# Altium schematic sheet Microcontroller_07.SchDoc
size A4; SheetNumber: 8; SheetTotal: 9
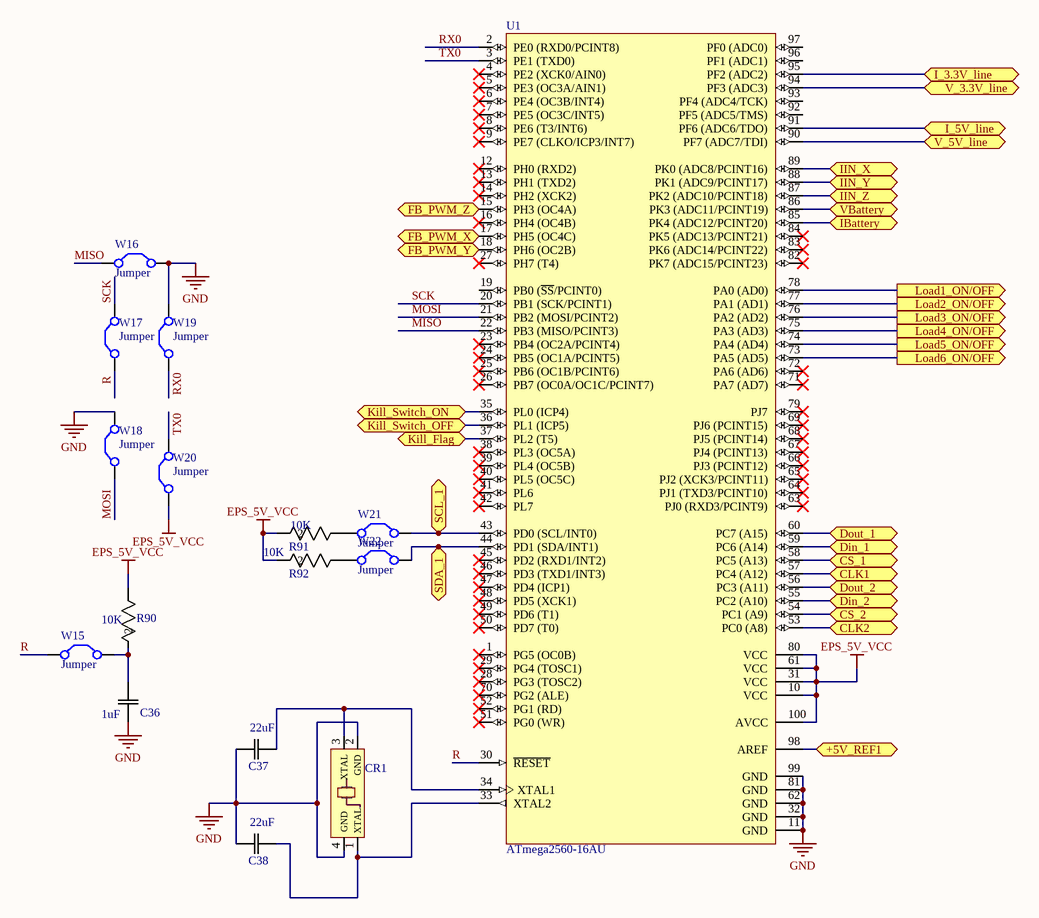
[diagram p0: Microcontroller_07.SchDoc]

## Parts
C36  1uF  [0805]
C37  22uF  [0805]
C38  22uF  [0805]
CR1  ABM3B-16.000MHZ  [Crystal]  (value not drawn)
R90  10K  [RC0805N]
R91  10K  [RC0805N]
R92  10K  [RC0805N]
U1  ATmega2560-16AU  [100A_M]
W15  Jumper  [RAD-0.1]
W16  Jumper  [RAD-0.1]
W17  Jumper  [RAD-0.1]
W18  Jumper  [RAD-0.1]
W19  Jumper  [RAD-0.1]
W20  Jumper  [RAD-0.1]
W21  Jumper  [RAD-0.1]
W22  Jumper  [RAD-0.1]

## Ports
+5V_REF1, CLK1, CLK2, CS_1, CS_2, Din_1, Din_2, Dout_1, Dout_2, FB_PWM_X, FB_PWM_Y, FB_PWM_Z, I_3.3V_line, I_5V_line, IBattery, IIN_X, IIN_Y, IIN_Z, Kill_Flag, Kill_Switch_OFF, Kill_Switch_ON, Load1_ON/OFF (out), Load2_ON/OFF (out), Load3_ON/OFF (out), Load4_ON/OFF (out), Load5_ON/OFF (out), Load6_ON/OFF (out), SCL_1, SDA_1, V_3.3V_line (bidir), V_5V_line, VBattery

## Nets
EPS_5V_VCC: R90.1 R91.2 R92.2 U1.10(VCC) U1.31(VCC) U1.61(VCC) U1.80(VCC) U1.100(AVCC) W20.1(C1)
GND: C36.1 C37.1 C38.1 CR1.2(GND) CR1.4(GND) U1.11(GND) U1.32(GND) U1.62(GND) U1.81(GND) U1.99(GND) W16.2(C2) W18.2(C2) W19.2(C2)
+5V_REF1: U1.98(AREF) ; port +5V_REF1
CLK1: U1.57(PC4_(A12)) ; port CLK1
CLK2: U1.53(PC0_(A8)) ; port CLK2
CS_1: U1.58(PC5_(A13)) ; port CS_1
CS_2: U1.54(PC1_(A9)) ; port CS_2
Din_1: U1.59(PC6_(A14)) ; port Din_1
Din_2: U1.55(PC2_(A10)) ; port Din_2
Dout_1: U1.60(PC7_(A15)) ; port Dout_1
Dout_2: U1.56(PC3_(A11)) ; port Dout_2
FB_PWM_X: U1.17(PH5_(OC4C)) ; port FB_PWM_X
FB_PWM_Y: U1.18(PH6_(OC2B)) ; port FB_PWM_Y
FB_PWM_Z: U1.15(PH3_(OC4A)) ; port FB_PWM_Z
I_3.3V_line: U1.95(PF2_(ADC2)) ; port I_3.3V_line
I_5V_line: U1.91(PF6_(ADC6/TDO)) ; port I_5V_line
IBattery: U1.85(PK4_(ADC12/PCINT20)) ; port IBattery
IIN_X: U1.89(PK0_(ADC8/PCINT16)) ; port IIN_X
IIN_Y: U1.88(PK1_(ADC9/PCINT17)) ; port IIN_Y
IIN_Z: U1.87(PK2_(ADC10/PCINT18)) ; port IIN_Z
Kill_Flag: U1.37(PL2_(T5)) ; port Kill_Flag
Kill_Switch_OFF: U1.36(PL1_(ICP5)) ; port Kill_Switch_OFF
Kill_Switch_ON: U1.35(PL0_(ICP4)) ; port Kill_Switch_ON
Load1_ON/OFF: U1.78(PA0_(AD0)) ; port Load1_ON/OFF
Load2_ON/OFF: U1.77(PA1_(AD1)) ; port Load2_ON/OFF
Load3_ON/OFF: U1.76(PA2_(AD2)) ; port Load3_ON/OFF
Load4_ON/OFF: U1.75(PA3_(AD3)) ; port Load4_ON/OFF
Load5_ON/OFF: U1.74(PA4_(AD4)) ; port Load5_ON/OFF
Load6_ON/OFF: U1.73(PA5_(AD5)) ; port Load6_ON/OFF
MISO: U1.22(PB3_(MISO/PCINT3)) W16.1(C1)
MOSI: U1.21(PB2_(MOSI/PCINT2)) W18.1(C1)
R: U1.30(~{RESET}) W15.1(C1) W17.1(C1)
RX0: U1.2(PE0_(RXD0/PCINT8)) W19.1(C1)
SCK: U1.20(PB1_(SCK/PCINT1)) W17.2(C2)
SCL_1: U1.43(PD0_(SCL/INT0)) W21.2(C2) ; port SCL_1
SDA_1: U1.44(PD1_(SDA/INT1)) W22.2(C2) ; port SDA_1
TX0: U1.3(PE1_(TXD0)) W20.2(C2)
V_3.3V_line: U1.94(PF3_(ADC3)) ; port V_3.3V_line
V_5V_line: U1.90(PF7_(ADC7/TDI)) ; port V_5V_line
VBattery: U1.86(PK3_(ADC11/PCINT19)) ; port VBattery
NetC36_2: C36.2 R90.2 W15.2(C2)
NetC37_2: C37.2 CR1.3(XTAL) U1.34(XTAL1)
NetC38_2: C38.2 CR1.1(XTAL) U1.33(XTAL2)
NetR91_1: R91.1 W21.1(C1)
NetR92_1: R92.1 W22.1(C1)

Not connected (* = marked no-connect by the designer): U1 1(PG5_(OC0B))* 4(PE2_(XCK0/AIN0))* 5(PE3_(OC3A/AIN1))* 6(PE4_(OC3B/INT4))* 7(PE5_(OC3C/INT5))* 8(PE6_(T3/INT6))* 9(PE7_(CLKO/ICP3/INT7))* 12(PH0_(RXD2))* 13(PH1_(TXD2))* 14(PH2_(XCK2))* 16(PH4_(OC4B))* 19(PB0_(~{SS}/PCINT0)) 23(PB4_(OC2A/PCINT4))* 24(PB5_(OC1A/PCINT5))* 25(PB6_(OC1B/PCINT6))* 26(PB7_(OC0A/OC1C/PCINT7))* 27(PH7_(T4))* 28(PG3_(TOSC2))* 29(PG4_(TOSC1))* 38(PL3_(OC5A))* 39(PL4_(OC5B))* 40(PL5_(OC5C))* 41(PL6)* 42(PL7)* 45(PD2_(RXD1/INT2))* 46(PD3_(TXD1/INT3))* 47(PD4_(ICP1))* 48(PD5_(XCK1))* 49(PD6_(T1))* 50(PD7_(T0))* 51(PG0_(WR))* 52(PG1_(RD))* 63(PJ0_(RXD3/PCINT9))* 64(PJ1_(TXD3/PCINT10))* 65(PJ2_(XCK3/PCINT11))* 66(PJ3_(PCINT12))* 67(PJ4_(PCINT13))* 68(PJ5_(PCINT14))* 69(PJ6_(PCINT15))* 70(PG2_(ALE))* 71(PA7_(AD7))* 72(PA6_(AD6))* 79(PJ7)* 82(PK7_(ADC15/PCINT23))* 83(PK6_(ADC14/PCINT22))* 84(PK5_(ADC13/PCINT21))* 92(PF5_(ADC5/TMS)) 93(PF4_(ADC4/TCK)) 96(PF1_(ADC1)) 97(PF0_(ADC0))

## Library data of the parts
C36 = GRM155R71H103KA8: Ceramic Capacitor 1uF; Manufacturer_Part_Number: GRM155R71H103KA88D; Vendor: Murata; C: Copyright (C) 2015 Accelerated Designs. All rights reserved; Copyright: Copyright (C) 2015 Accelerated Designs. All rights reserved; Value: Value; Package/Case: 0402(1005metric)
C37 C38 = GRM155R71H103KA8: Ceramic Capacitor 22uF; Manufacturer_Part_Number: GRM155R71H103KA88D; Vendor: Murata; C: Copyright (C) 2015 Accelerated Designs. All rights reserved; Copyright: Copyright (C) 2015 Accelerated Designs. All rights reserved; Value: Value
CR1 = ABM3B-16.000MHZ-10-1-U-T: CRYSTAL 16.0000MHZ 10PF SMD
R90 R92 = RC0805FR: Thick Film Resistors 10k ohm; Manufacturer_Part_Number: RC0805FR-074K7L; Vendor: Yageo; Resistance_In_Ohms: 4.70K; Power_(Watts): 0.125W, 1/8W; Tolerance: Â±1%; Lead_Style: Surface Mount (SMD - SMT); Voltage_-_Working: 150V; Temperature_Coefficient: Â±100ppm/Â°C; Resistance_(Ohms): 4.7K; Number_of_Terminations: 2; C: Copyright (C) 2015 Accelerated Designs. All rights reserved; DigiKeyPartNumber: 311-4.70KCRTR-ND; Quantity_Available: 0; Copyright: Copyright (C) 2015 Accelerated Designs. All rights reserved; DataSheet: http://www.yageo.com/documents/recent/PYu-RC0805_51_RoHS_L_4.pdf; Case: 0805 (2012 metric); Packaging: Tape &amp; Reel (TR); Composition: Thick Film; NewarkPartNumber: 10R0398; Features: -; Package_/_Case: 0805 (2012 Metric); Size_/_Dimension: 0.079" L x 0.049" W (2.00mm x 1.25mm); Height: 0.024" (0.60mm); Value: Value
R91 = RC0805FR: Thick Film Resistors 10kohm; Manufacturer_Part_Number: RC0805FR-074K7L; Vendor: Yageo; Resistance_In_Ohms: 4.70K; Power_(Watts): 0.125W, 1/8W; Tolerance: Â±1%; Lead_Style: Surface Mount (SMD - SMT); Voltage_-_Working: 150V; Temperature_Coefficient: Â±100ppm/Â°C; Resistance_(Ohms): 4.7K; Number_of_Terminations: 2; C: Copyright (C) 2015 Accelerated Designs. All rights reserved; DigiKeyPartNumber: 311-4.70KCRTR-ND; Quantity_Available: 0; Copyright: Copyright (C) 2015 Accelerated Designs. All rights reserved; DataSheet: http://www.yageo.com/documents/recent/PYu-RC0805_51_RoHS_L_4.pdf; Case: 0805 (2012 metric); Packaging: Tape &amp; Reel (TR); Composition: Thick Film; NewarkPartNumber: 10R0398; Features: -; Package_/_Case: 0805 (2012 Metric); Size_/_Dimension: 0.079" L x 0.049" W (2.00mm x 1.25mm); Height: 0.024" (0.60mm); Value: Value
U1 = ATmega2560-16AU: 8-bit AVR Microcontroller, 4.5-5.5V, 256KB Flash, 4KB EEPROM, 8KB SRAM, 86 GPIO pins, 100-pin TQFP, Industrial Grade (-40°C to 85°C), Pb-Free; Published: 1-Apr-2010; DatasheetVersion: revL, Aug-2007; PackageVersion: revC, Oct-2001; PackageReference: 100A; Publisher: Altium Limited; PackageDescription: 100-Pin Thin Profile Plastic Quad Flat Pack (TQFP), 14 x 14 x 1.0 mm Body, 0.5 mm Pitch; Supplier 1: Digi-Key; Supplier Part Number 1: ATMEGA2560-16AU-ND; Supplier 2: Farnell; Supplier Part Number 2: 1288330; Supplier 3: Farnell; Supplier Part Number 3: 1661740; Supplier 4: Mouser; Supplier Part Number 4: 556-ATMEGA2560-16AU; Code_JEDEC: MS-026-AED; ComponentLink1Description: Manufacturer Link; ComponentLink1URL: http://www.atmel.com/products/avr/default.asp?; ComponentLink2Description: ATmega640/1280/1281/2560/2561 Datasheet; ComponentLink2URL: http://www.atmel.com/dyn/resources/prod_documents/doc2549.pdf; ComponentLink3Description: ATmega640/1280/1281/2560/2561 Summary; ComponentLink3URL: http://www.atmel.com/dyn/resources/prod_documents/2549S.pdf; ComponentLink4Description: Atmel.com Home; ComponentLink4URL: http://www.atmel.com
W15-W22 = Jumper: Jumper Wire; Published: 24-Mar-1999; LatestRevisionDate: 17-Jul-2002; LatestRevisionNote: Re-released for DXP Platform.; PackageReference: RAD-0.2; Publisher: Altium Limited; PackageDescription: Radial Cap, Thru-Hole; 2 Leads; 0.2 in Pin Spacing